# EAGLE schematic LDR mk2 (EAGLE 9.4.2)
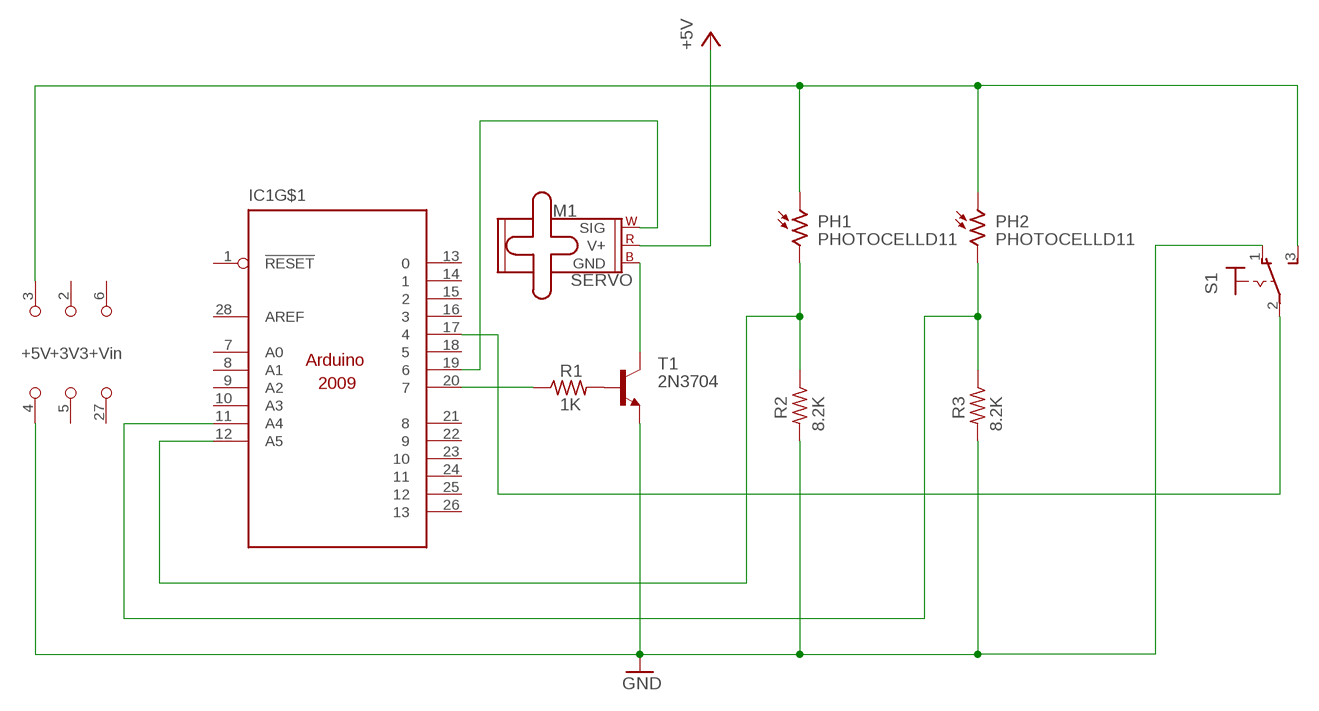
[diagram p0: schematic, sheet 1]

## Parts
IC1  ARDUINO2009_20  [ARDUINO2009]
M1  SERVO  [1X03]
PH1  PHOTOCELLD11  [D11XX_H]
PH2  PHOTOCELLD11  [D11XX_H]
R1  1K  R-US_0204/7  [0204/7]
R2  8.2K  R-US_0204/5  [0204/5]
R3  8.2K  R-US_0204/5  [0204/5]
S1  320-916  [320-916]
T1  2N3704  [TO92]

## Nets
GND: IC1.4(GND) R2.2 R3.2 S1.1(O) T1.3(E)
N$1: IC1.20 R1.1
N$2: R1.2 T1.1(B)
N$3: M1.3(GND) T1.2(C)
N$4: IC1.19 M1.1(SIG)
N$5: IC1.3(+5V) PH1.1 PH2.1 S1.3(S)
N$8: IC1.12(A5) PH1.2 R2.1
N$9: IC1.11(A4) PH2.2 R3.1
N$10: IC1.17 S1.2(P)
VCC: M1.2(V+) ; supply symbol labelled +5V
Unconnected: IC1.1(!RESET) IC1.7(A0) IC1.8(A1) IC1.9(A2) IC1.10(A3) IC1.13 IC1.14 IC1.15 IC1.16 IC1.18 IC1.21 IC1.22 IC1.23 IC1.24 IC1.25 IC1.26 IC1.28(AREF)

## Power pins joined to a net without a drawn wire
+3V3: IC1.2(+3V3)
+VIN: IC1.6(+VIN)
GND: IC1.5(GND) IC1.27(GND)

## Library data of the parts
IC1 = arduino:ARDUINO2009_2: The Arduino Duemilanove ("2009") is a microcontroller board based on the ATmega168 or ATmega328. - 14 digital input/output pins (of which 6 can be used as PWM outputs) - 6 analog inputs, a 16 MHz crystal oscillator - USB connection - power jack - ISP header - reset button It contains everything needed to support the microcontroller; simply connect it to a computer with a USB cable or power it with a AC-to-DC adapter or battery to get started http://arduino.cc/en/Main/ArduinoBoardDuemilanove
M1 = SparkFun-Electromechanical:SERVO: Servo Motor 3-pin connector for a standard servo motor (voltage supply, ground, and control signal.) SparkFun Products Servo - Generic (Sub-Micro Size) <https://www.sparkfun.com/products/9065> (ROB-09065) Servo - Generic High Torque Continuous Rotation (Standard Size) <https://www.sparkfun.com/products/9347> (ROB-09347) Servo - Generic High Torque (Standard Size) <https://www.sparkfun.com/products/11965> (ROB-11965)
PH1 PH2 = photo-elements:PHOTOCELL: Photo Sensor
R1-R3 = adafruit:R-US_: RESISTOR, American symbol
S1 = switch:320-916: TOGGLE SWITCH distributor RS Components
T1 = transistor-neu-to92:2N3704: NPN TRANSISTOR